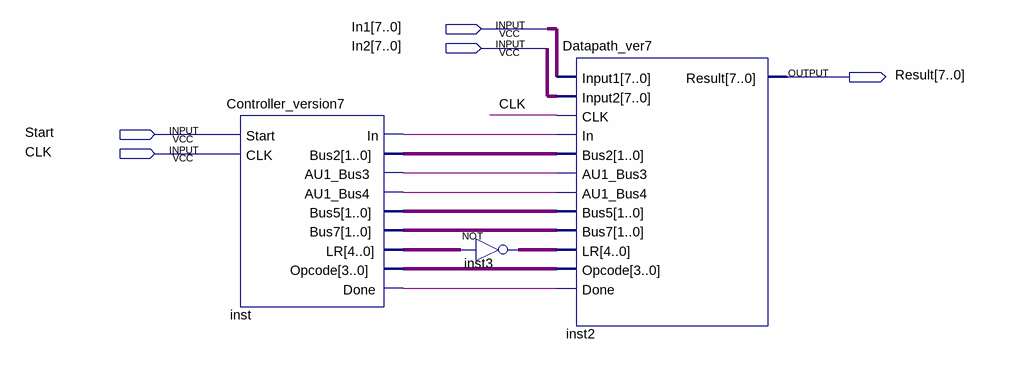
[diagram p0: schematic sheet]
// Quartus schematic ver7.bdf as structural Verilog: 3 symbols, 5 pins
module ver7 (
  input  [7:0] In1,
  input  [7:0] In2,
  input  Start,
  input  CLK,
  output [7:0] Result
);

  wire inst_au1_bus3, inst_au1_bus4, inst_done, inst_in;
  wire [1:0] inst_bus2, inst_bus5, inst_bus7;
  wire [3:0] inst_opcode;
  wire [4:0] inst3_out, inst_lr;

  Controller_version7 inst (
    .Start(Start), .CLK(CLK), .In(inst_in), .Bus2(inst_bus2), .AU1_Bus3(inst_au1_bus3),
    .AU1_Bus4(inst_au1_bus4), .Bus5(inst_bus5), .Bus7(inst_bus7), .LR(inst_lr), .Opcode(inst_opcode),
    .Done(inst_done));
  assign inst3_out = ~inst_lr;  // NOT inst3, 5 bits wide
  Datapath_ver7 inst2 (
    .Input1(In1), .Input2(In2), .CLK(CLK), .In(inst_in), .Bus2(inst_bus2), .AU1_Bus3(inst_au1_bus3),
    .AU1_Bus4(inst_au1_bus4), .Bus5(inst_bus5), .Bus7(inst_bus7), .LR(inst3_out), .Opcode(inst_opcode),
    .Done(inst_done), .Result(Result));
endmodule
